# EAGLE design Programmer (EAGLE 6.4)
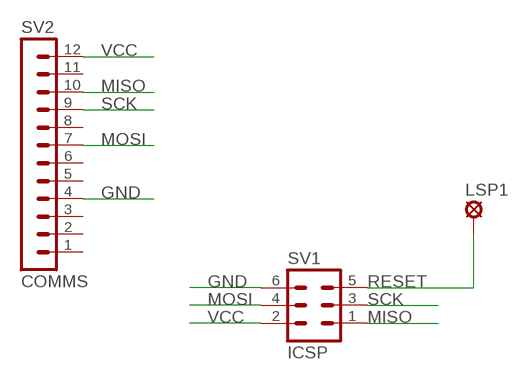
[diagram p0: schematic, sheet 1]

## Parts
LSP1  MCS10B  [MCS10B]
SV1  ICSP  MA03-2  [MA03-2]
SV2  COMMS  MA12-1W  [MA12-1W]

## Nets
GND: SV1.6 SV2.4
MISO: SV1.1 SV2.10
MOSI: SV1.4 SV2.7
RESET: LSP1.MP SV1.5
SCK: SV1.3 SV2.9
VCC: SV1.2 SV2.12
Unconnected: SV2.1 SV2.2 SV2.3 SV2.5 SV2.6 SV2.8 SV2.11

## Library data of the parts
LSP1 = solpad:MCS10B: SOLDER PAD MC S1, distributor Buerklin, 15F505
SV1 = con-lstb:MA03-2: PIN HEADER; OC_FARNELL: unknown; OC_NEWARK: unknown
SV2 = con-lstb:MA12-1W: PIN HEADER; OC_FARNELL: unknown; OC_NEWARK: unknown

## Board
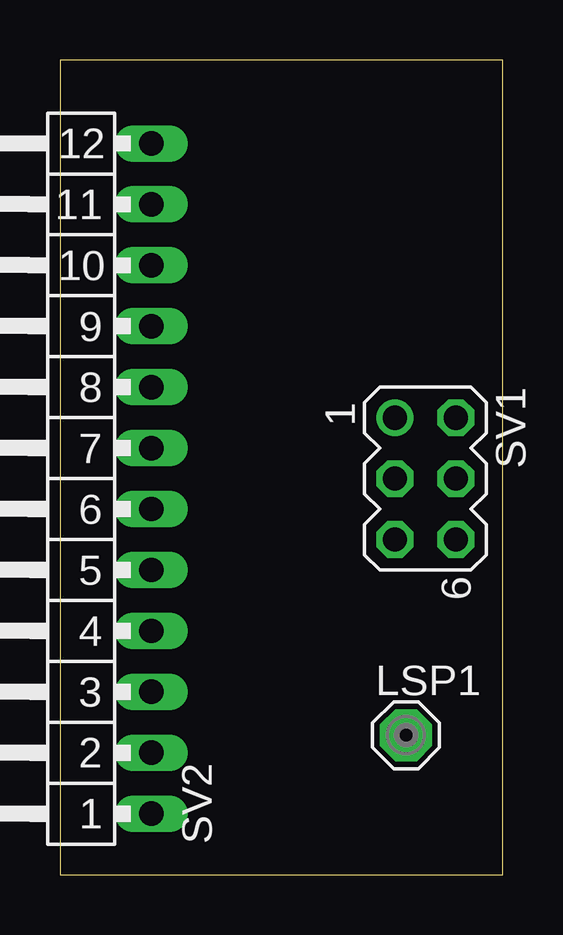
[diagram p1: board, top side]
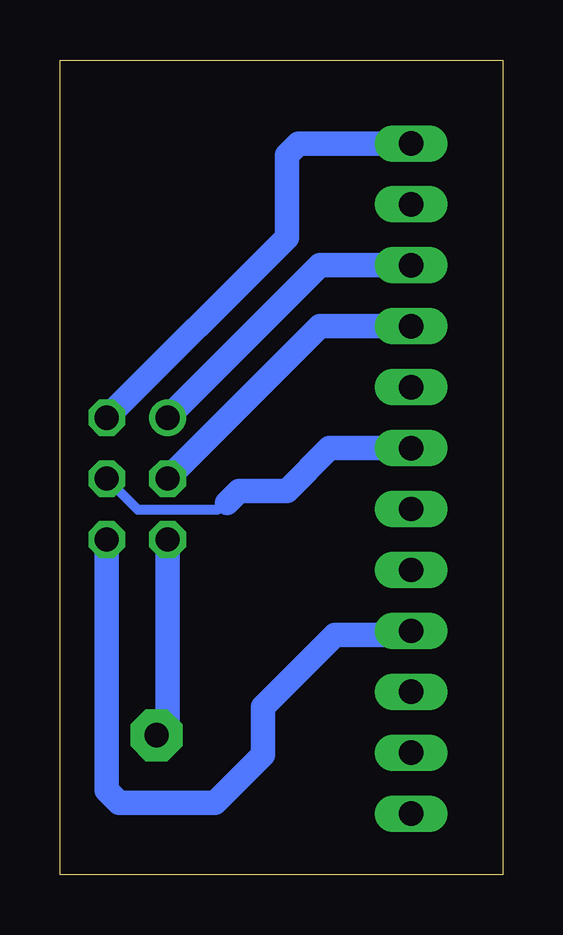
[diagram p2: board, bottom side, seen from below]

Size 18.46 x 33.96 mm. Coordinates in mm from the lower left corner, seen from the top.
Outline: 0,0 18.46,0 18.46,33.96 0,33.96 0,0
Copper layers (1*16): Top 0.035mm / dielectric 1.5mm / Bottom 0.035mm
Design rules "default": minimum track width 10mil, minimum drill 24mil, track to track 8mil, track to pad 8mil, pad to pad 8mil, via to via 8mil, smd to smd 8mil, copper to edge 40mil, drill to drill 8mil, minimum pad ring 10mil, minimum via ring 8mil, stop-mask expansion 4mil, vias tented up to drill 0mil, thermal gap 10mil

### Footprints (pad centres in the part's own frame; a part is rotated, then mirrored left to right if it is on the bottom)
MCS10B = drill 1.016 pad 2.159 octagon: MP 0,0
MA03-2 = drill 1.016: 1 -2.54,-1.27 | drill 1.016 octagon: 2 -2.54,1.27; 3 0,-1.27; 4 0,1.27; 5 2.54,-1.27; 6 2.54,1.27
MA12-1W = drill 1.016 long: 1 -13.97,0; 2 -11.43,0; 3 -8.89,0; 4 -6.35,0; 5 -3.81,0; 6 -1.27,0; 7 1.27,0; 8 3.81,0; 9 6.35,0; 10 8.89,0; 11 11.43,0; 12 13.97,0

### Placement (x,y rotation side)
LSP1  14.43,5.81 0 top
SV1  15.24,16.51 270 top
SV2  3.81,16.51 90 top

### Tracks (layer width: path | path; a pad name or v marks a point on that pad's centre or on a via)
GND
  Bottom 1.016: SV1.6 16.51,3.51 16,3 12,3 10,5 10,7 7,10 3.97,10 SV2.4
MISO
  Bottom 1.016: SV2.10 7.62,25.4 SV1.1
MOSI
  Bottom 0.406: 11.5,15.5 11.9,15.2 15.2,15.2 SV1.4
  Bottom 1.016: SV2.7 7.22,17.78 9,16 11,16 11.5,15.5
RESET
  Bottom 1.016: SV1.5 13.97,6.27 LSP1.MP
SCK
  Bottom 1.016: SV2.9 7.62,22.86 SV1.3
VCC
  Bottom 1.016: SV2.12 8.52,30.48 9,30 9,26.56 SV1.2